# EAGLE design PCB (EAGLE 9.2.0)
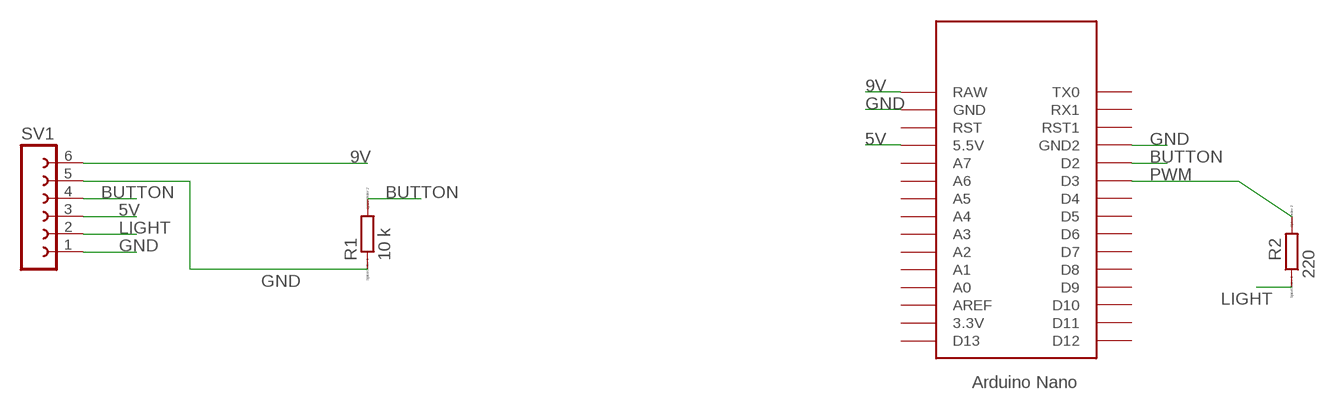
[diagram p0: schematic, sheet 1]

## Parts
R1  10 k  R  [R0805]
R2  220  R  [R0805]
SV1  FE06-1  [FE06]
U$1  NANO  [NANO]

## Nets
5V: SV1.3 U$1.5V(5.5V)
9V: SV1.6 U$1.RAW
BUTTON: R1.2 SV1.4 U$1.D2
GND: R1.1 SV1.1 SV1.5 U$1.GND U$1.GND1(GND2)
LIGHT: R2.1 SV1.2
PWM: R2.2 U$1.D3
Unconnected: U$1.3.3V U$1.A0 U$1.A1 U$1.A2 U$1.A3 U$1.A4 U$1.A5 U$1.A6 U$1.A7 U$1.AREF U$1.D4 U$1.D5 U$1.D6 U$1.D7 U$1.D8 U$1.D9 U$1.D10 U$1.D11 U$1.D12 U$1.D13 U$1.ICSP1 U$1.ICSP2 U$1.ICSP3 U$1.ICSP4 U$1.ICSP5 U$1.ICSP6 U$1.RST U$1.RST1 U$1.RX1 U$1.TX0

## Library data of the parts
R1 R2 = eagle-ltspice:R: RESISTOR, European symbol; SPICEMODEL: NONE; SPICEPREFIX: R
SV1 = con-lsta:FE06-1: FEMALE HEADER; OC_FARNELL: unknown; OC_NEWARK: unknown
U$1 = Arduino-clone:NANO: Arduino Nano

## Board
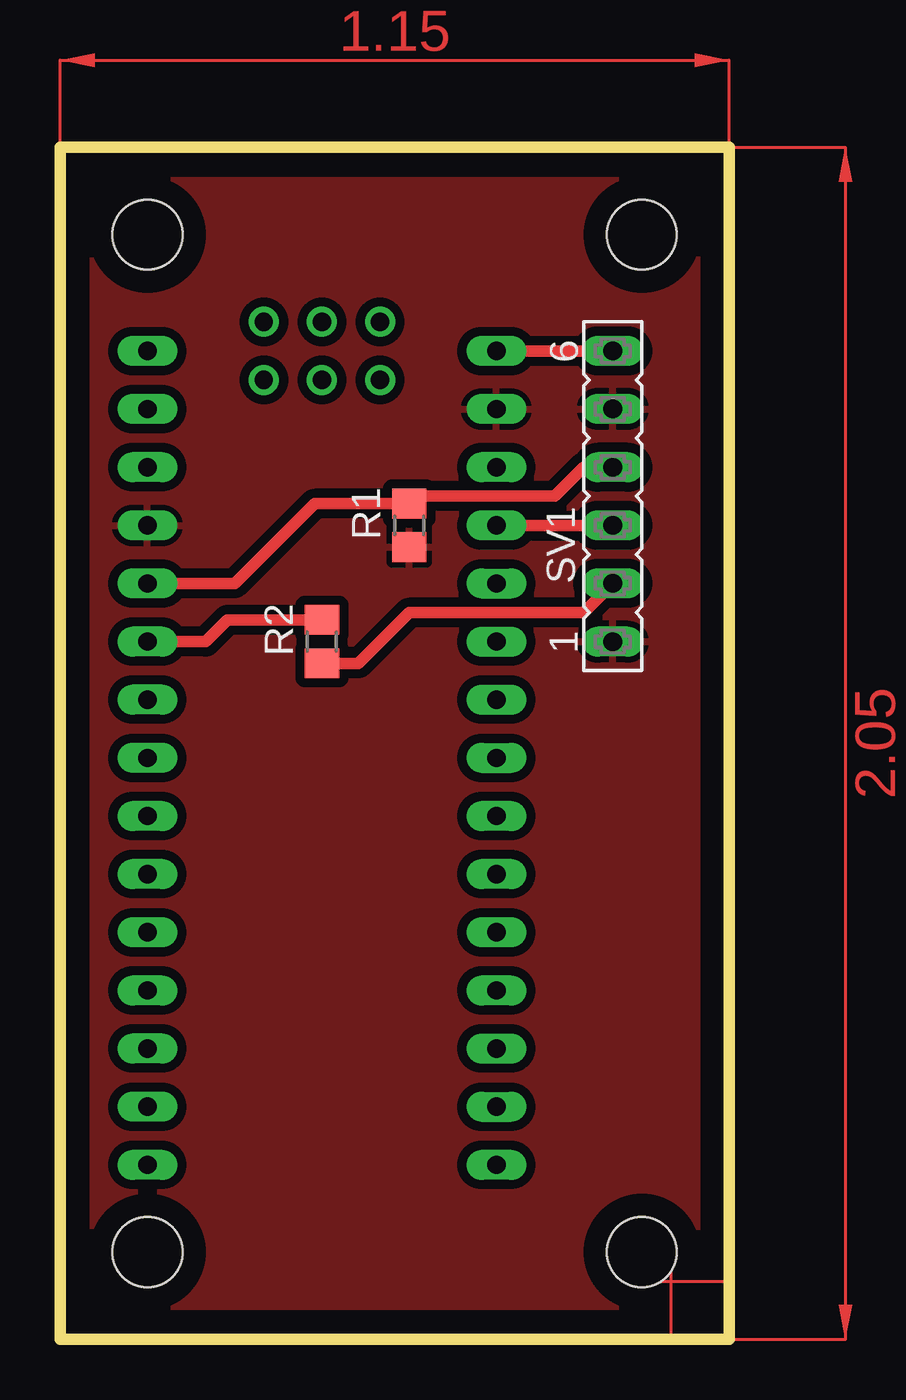
[diagram p1: board, top side]

Size 29.21 x 52.07 mm. Coordinates in mm from the lower left corner, seen from the top.
Outline: 0,52.07 29.21,52.07 29.21,0 0,0 0,52.07
Copper layers (1*16): Top 0.035mm / dielectric 1.5mm / Bottom 0.035mm
Design rules "default": minimum track width 6mil, minimum drill 0.35mm, track to track 6mil, track to pad 6mil, pad to pad 6mil, via to via 6mil, smd to smd 6mil, copper to edge 40mil, drill to drill 6mil, minimum pad ring 10mil, minimum via ring 8mil, stop-mask expansion 4mil, vias tented up to drill 0mil, thermal gap 10mil
Holes 3.05 mm at 3.81,48.26 25.4,48.26 3.81,3.81 25.4,3.81

### Footprints (pad centres in the part's own frame; a part is rotated, then mirrored left to right if it is on the bottom)
R0805 = smd 1.3 x 1.5: 1 -0.95,0; 2 0.95,0
FE06 = drill 0.813 long: 1 -6.35,0; 2 -3.81,0; 3 -1.27,0; 4 1.27,0; 5 3.81,0; 6 6.35,0
NANO = drill 0.8 long: 3.3V -10.16,24.13; 5V -10.16,-1.27; A0 -10.16,19.05; A1 -10.16,16.51; A2 -10.16,13.97; A3 -10.16,11.43; A4 -10.16,8.89; A5 -10.16,6.35; A6 -10.16,3.81; A7 -10.16,1.27; AREF -10.16,21.59; D2 5.08,1.27; D3 5.08,3.81; D4 5.08,6.35; D5 5.08,8.89; D6 5.08,11.43; D7 5.08,13.97; D8 5.08,16.51; D9 5.08,19.05; D10 5.08,21.59; D11 5.08,24.13; D12 5.08,26.67; D13 -10.16,26.67; GND -10.16,-6.35; GND1 5.08,-1.27; RAW -10.16,-8.89; RST -10.16,-3.81; RST1 5.08,-3.81; RX1 5.08,-6.35; TX0 5.08,-8.89 | drill 0.8: ICSP1 -5.08,-10.16; ICSP2 -5.08,-7.62; ICSP3 -2.54,-10.16; ICSP4 -2.54,-7.62; ICSP5 0,-10.16; ICSP6 0,-7.62

### Placement (x,y rotation side)
R1  15.24,35.56 90 top
R2  [R0805]  11.43,30.48 90 top
SV1  24.13,36.83 90 top
U$1  8.89,34.29 180 top

### Tracks (layer width: path | path; a pad name or v marks a point on that pad's centre or on a via)
5V
  Top 0.508: U$1.5V SV1.3
9V
  Top 0.508: SV1.6 U$1.RAW
BUTTON
  Top 0.508: SV1.4 22.86,38.1 21.59,36.83 15.56,36.83 R1.2 11.11,36.51 7.62,33.02 U$1.D2
GND
  pour Top (isolate 0.406): 1.27,50.8 27.94,50.8 27.94,1.27 1.27,1.27
  pour Top (isolate 0.508): 1.27,50.8 27.94,50.8 27.94,1.27 1.27,1.27
LIGHT
  Top 0.508: 11.43,29.21 R2.1 13.02,29.53 15.24,31.75 22.86,31.75 SV1.2
PWM
  Top 0.508: R2.2 7.3,31.43 6.35,30.48 U$1.D3
(copper drawn outside any net)
  shapes: Top area x5